# EAGLE design Blinky (EAGLE 6.2)
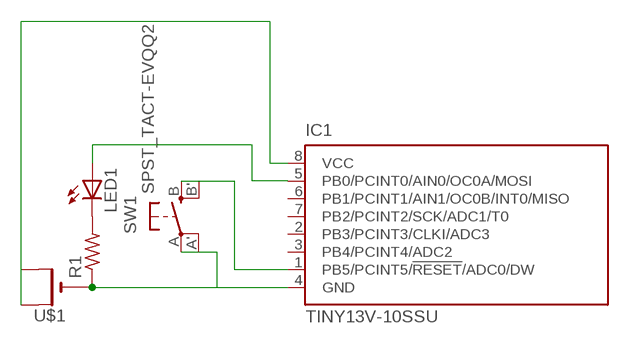
[diagram p0: schematic, sheet 1]

## Parts
IC1  TINY13V-10SSU  [8S1]
LED1  LEDCHIPLED_1206  [CHIPLED_1206]
R1  R-US_M1206  [M1206]
SW1  SPST_TACT-EVQQ2  [EVQ-Q2]
U$1  CR1220SMT  [CR1220-SMD]

## Nets
N$1: IC1.4(GND) R1.1 SW1.A'(P1) SW1.A(P) U$1.-
N$2: IC1.8(VCC) U$1.+$1(+) U$1.+$2(+1)
N$3: IC1.1(PB5/PCINT5/!RESET!/ADC0/DW) SW1.B(S)
N$5: LED1.C R1.2
N$6: IC1.5(PB0/PCINT0/AIN0/OC0A/MOSI) LED1.A
Unconnected: IC1.2(PB3/PCINT3/CLKI/ADC3) IC1.3(PB4/PCINT4/ADC2) IC1.6(PB1/PCINT1/AIN1/OC0B/INT0/MISO) IC1.7(PB2/PCINT2/SCK/ADC1/T0) SW1.B'(S1)

## Library data of the parts
IC1 = atmel:TINY13: 8-bit AVR Microcontroller with 1K Bytes In-System Programmable Flash Source: http://www.atmel.com/dyn/resources/prod_documents/2535S.pdf; MPN: ATTINY13V-10SSU; OC_FARNELL: 1455135; OC_NEWARK: 58M3773
LED1 = adafruit:LED: LED OSRAM: - CHIPLED LG R971, LG N971, LY N971, LG Q971, LY Q971, LO R971, LY R971 LH N974, LH R974 LS Q976, LO Q976, LY Q976 LO Q996 - Hyper CHIPLED LW Q18S LB Q993, LB Q99A, LB R99A - SideLED LS A670, LO A670, LY A670, LG A670, LP A670 LB A673, LV A673, LT A673, LW A673 LH A674 LY A675 LS A676, LA A676, LO A676, LY A676, LW A676 LS A679, LY A679, LG A679 - Hyper Micro SIDELED® LS Y876, LA Y876, LO Y876, LY Y876 LT Y87S - SmartLED LW L88C, LW L88S LB L89C, LB L89S, LG L890 LS L89K, LO L89K, LY L89K LS L896, LA L896, LO L896, LY L896 - TOPLED LS T670, LO T670, LY T670, LG T670, LP T670 LSG T670, LSP T670, LSY T670, LOP T670, LYG T670 LG T671, LOG T671, LSG T671 LB T673, LV T673, LT T673, LW T673 LH T674 LS T676, LA T676, LO T676, LY T676, LB T676, LH T676, LSB T676, LW T676 LB T67C, LV T67C, LT T67C, LS T67K, LO T67K, LY T67K, LW E67C LS E67B, LA E67B, LO E67B, LY E67B, LB E67C, LV E67C, LT E67C LW T67C LS T679, LY T679, LG T679 LS T770, LO T770, LY T770, LG T770, LP T770 LB T773, LV T773, LT T773, LW T773 LH T774 LS E675, LA E675, LY E675, LS T675 LS T776, LA T776, LO T776, LY T776, LB T776 LHGB T686 LT T68C, LB T68C - Hyper Mini TOPLED® LB M676 - Mini TOPLED Santana® LG M470 LS M47K, LO M47K, LY M47K Source: http://www.osram.convergy.de/
R1 = adafruit:R-US_: RESISTOR, American symbol
SW1 = adafruit:SPST_TACT: SMT 6mm switch, EVQQ2 series http://www.ladyada.net/library/eagle
U$1 = adafruit:CR1220: CR1216/CR1220/CR1225 12mm 3V lithium coin cell Great for battery packup. Both SMT and THM holders. Note the THM package has the ground pads on both sides of the PCB so that the masks are the same - this reduces the cost

## Board
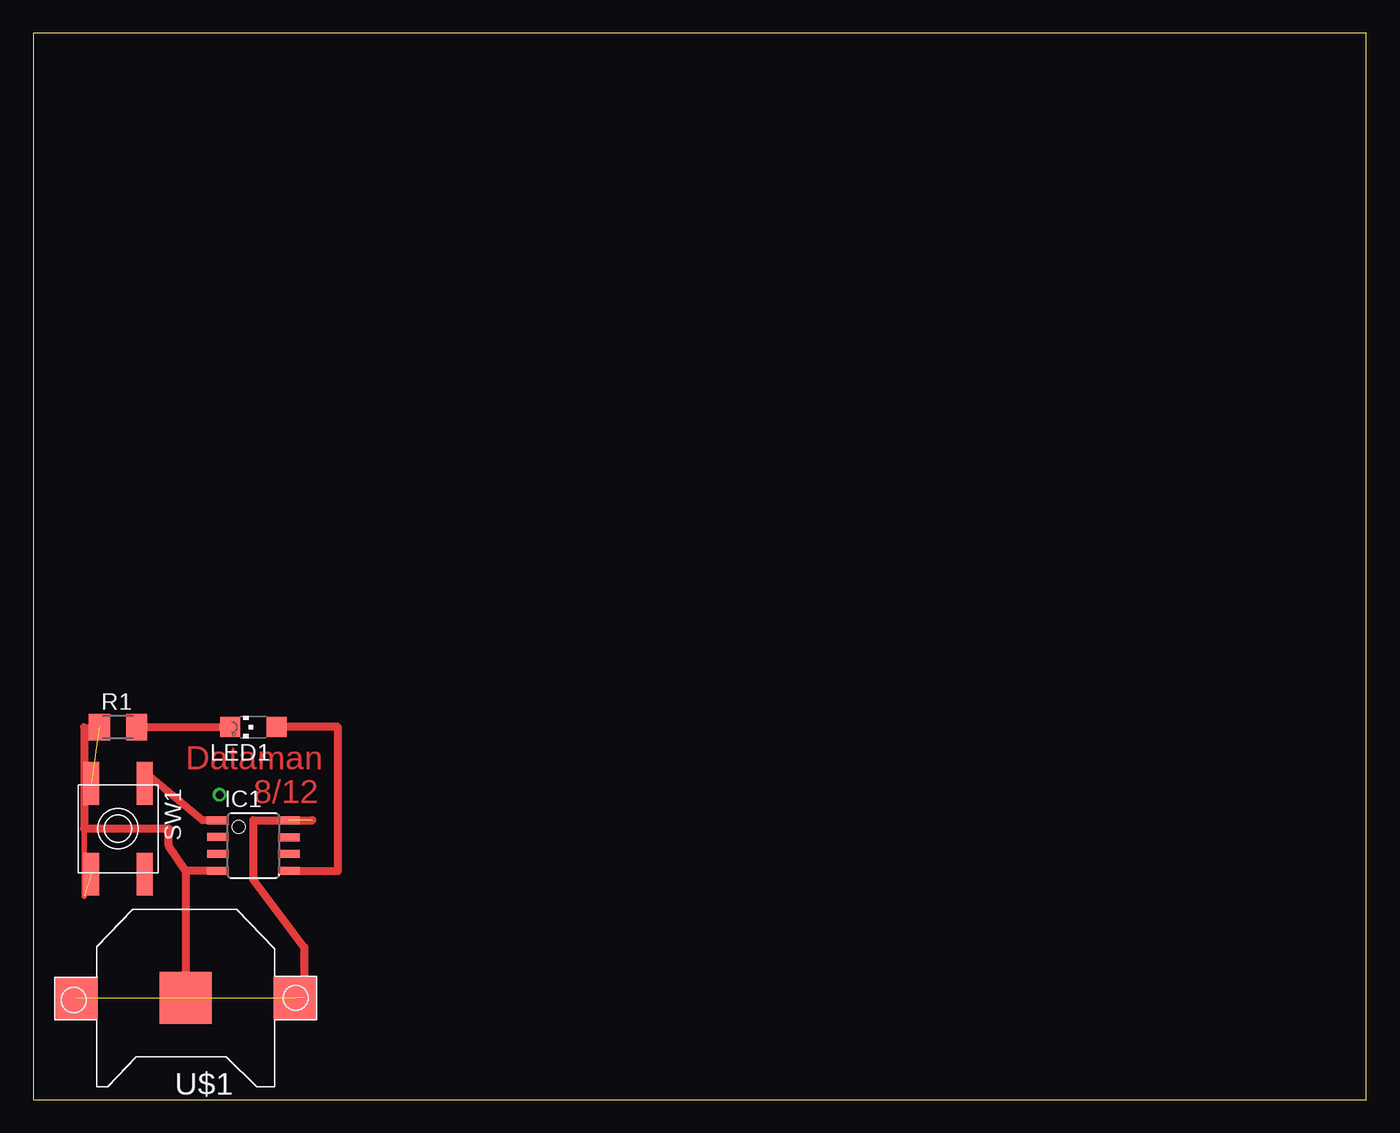
[diagram p1: board, top side]

Size 100 x 80 mm. Coordinates in mm from the lower left corner, seen from the top.
Outline: 0,0 100,0 100,80 0,80 0,0
Copper layers (1*16): Top 0.035mm / dielectric 1.5mm / Bottom 0.035mm
Design rules: minimum track width 10mil, minimum drill 24mil, track to track 8mil, track to pad 8mil, pad to pad 8mil, via to via 8mil, smd to smd 8mil, copper to edge 40mil, drill to drill 8mil, minimum pad ring 10mil, minimum via ring 8mil, stop-mask expansion 4mil, vias tented up to drill 0mil, thermal gap 10mil

### Footprints (pad centres in the part's own frame; a part is rotated, then mirrored left to right if it is on the bottom)
8S1 = smd 0.6 x 1.6: 1 -1.905,-2.654; 2 -0.645,-2.654; 3 0.625,-2.654; 4 1.895,-2.654; 5 1.905,2.654; 6 0.635,2.654; 7 -0.635,2.654; 8 -1.905,2.654
CHIPLED_1206 = smd 1.5 x 1.5: A 0,-1.75; C 0,1.75
M1206 = smd 1.6 x 2: 1 -1.4,0; 2 1.4,0
EVQ-Q2 = smd 3.2 x 1.2: A -3.4,-2; A' 3.4,-2; B -3.4,2; B' 3.4,2
CR1220-SMD = smd 3.2 x 3.2: +$1 -8.2,0; +$2 8.2,0 | smd 3.9 x 3.9: - 0,0

### Placement (x,y rotation side)
IC1  16.51,19.05 270 top
LED1  16.51,27.94 90 top
R1  6.35,27.94 0 top
SW1  6.35,20.32 270 top
U$1  11.43,7.62 180 top

### Tracks (layer width: path | path; a pad name or v marks a point on that pad's centre or on a via)
N$1  (2 unrouted)
  Top 0.406: R1.1 3.81,27.94 | 3.81,20.32 3.81,15.24
  Top 0.61: 3.81,27.94 3.81,20.32 8.89,20.32 10.16,20.32 10.16,19.05 11.43,17.16 | IC1.4 11.43,17.16 | 11.43,17.16 U$1.-
N$2  (3 unrouted)
  Top 0.61: 20.32,7.62 20.32,11.43 16.51,16.51 16.51,20.95 20.95,20.95
N$3
  Top 0.61: IC1.1 12.7,20.95 8.89,24.13 SW1.B
N$4  (via drill 0.6)
  other vias: 13.97,22.86
N$5
  Top 0.61: R1.2 LED1.C
N$6
  Top 0.61: IC1.5 22.86,17.14 22.86,27.94 LED1.A

### Text on the board
Top: Dataman | 8/12